# EAGLE design battery_monitor_6803-2_Rev4 (EAGLE 7.3.0)
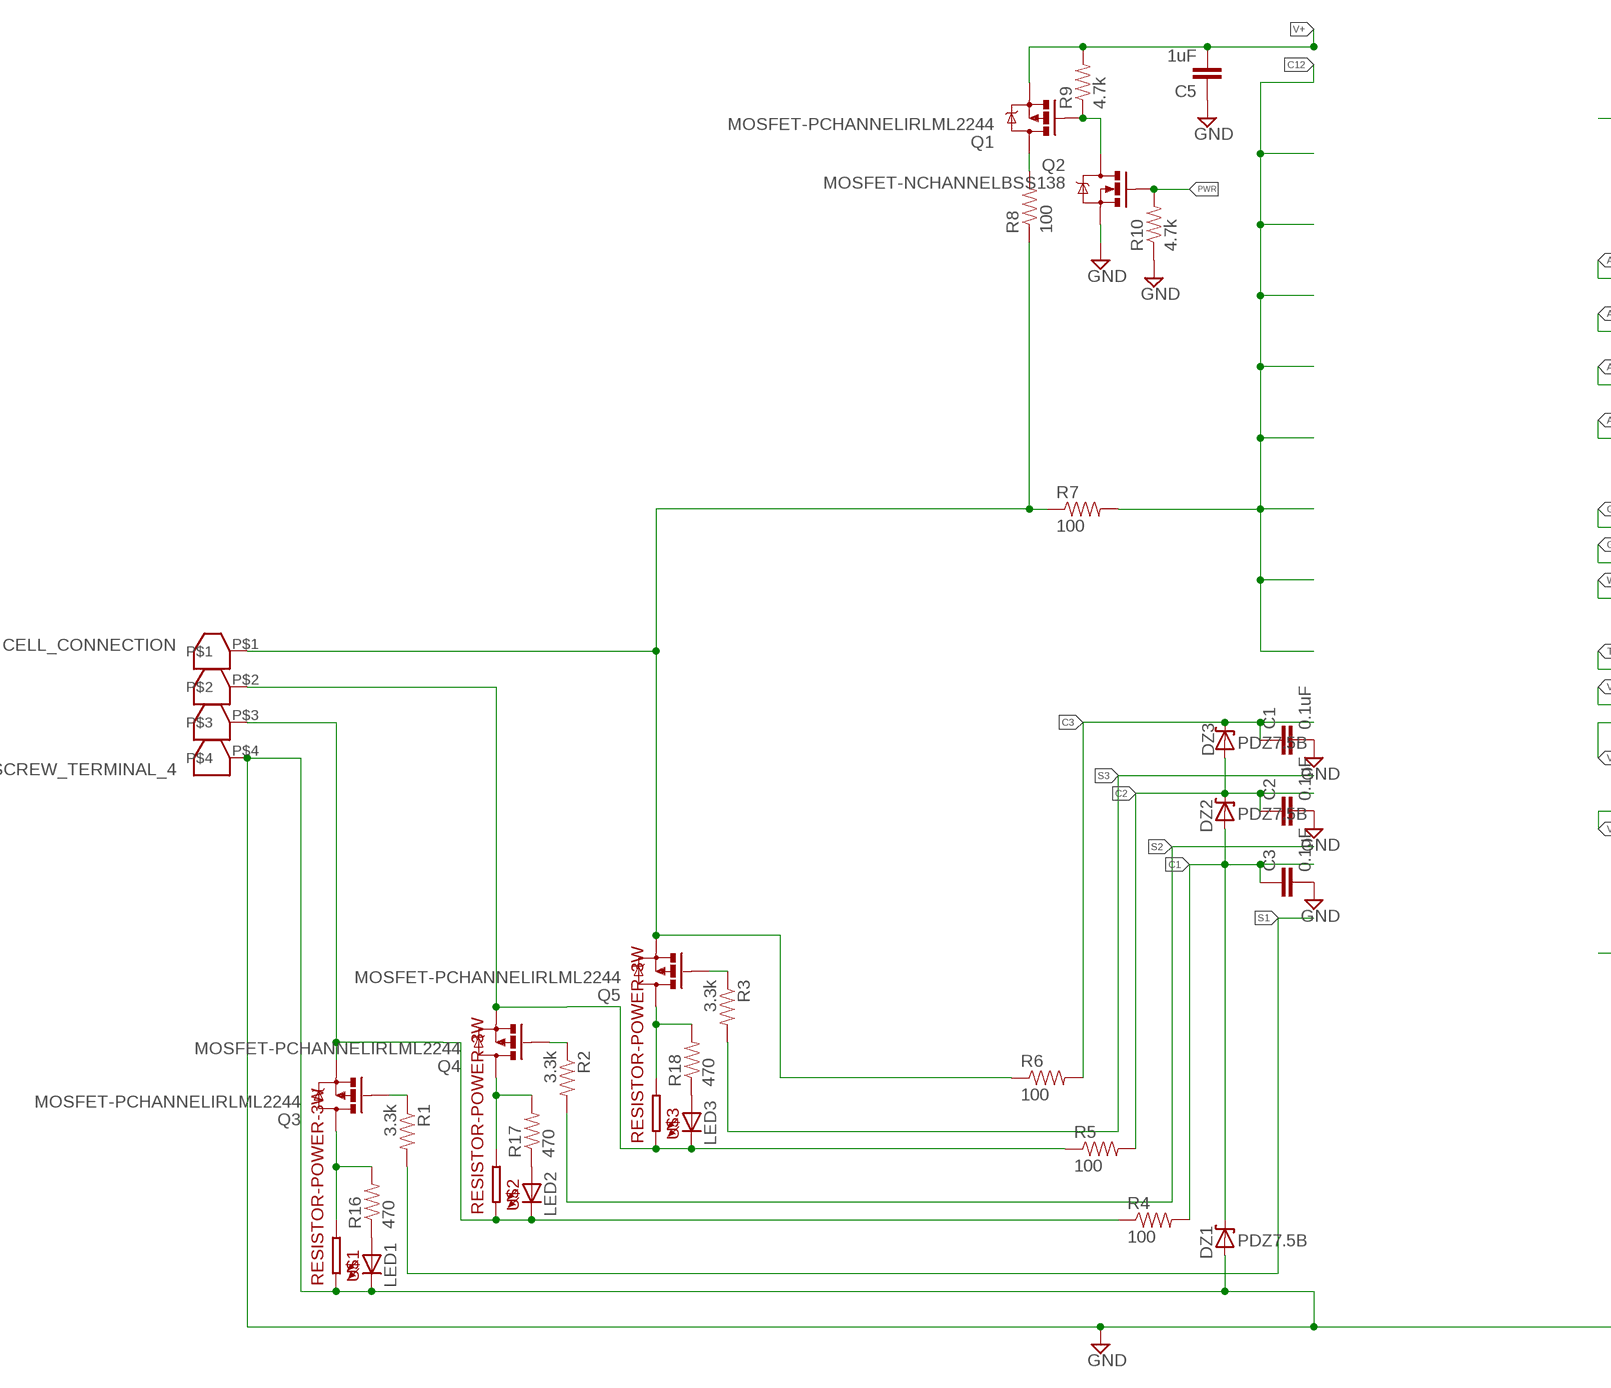
[diagram p0: schematic, sheet 1, part 1 of 2]
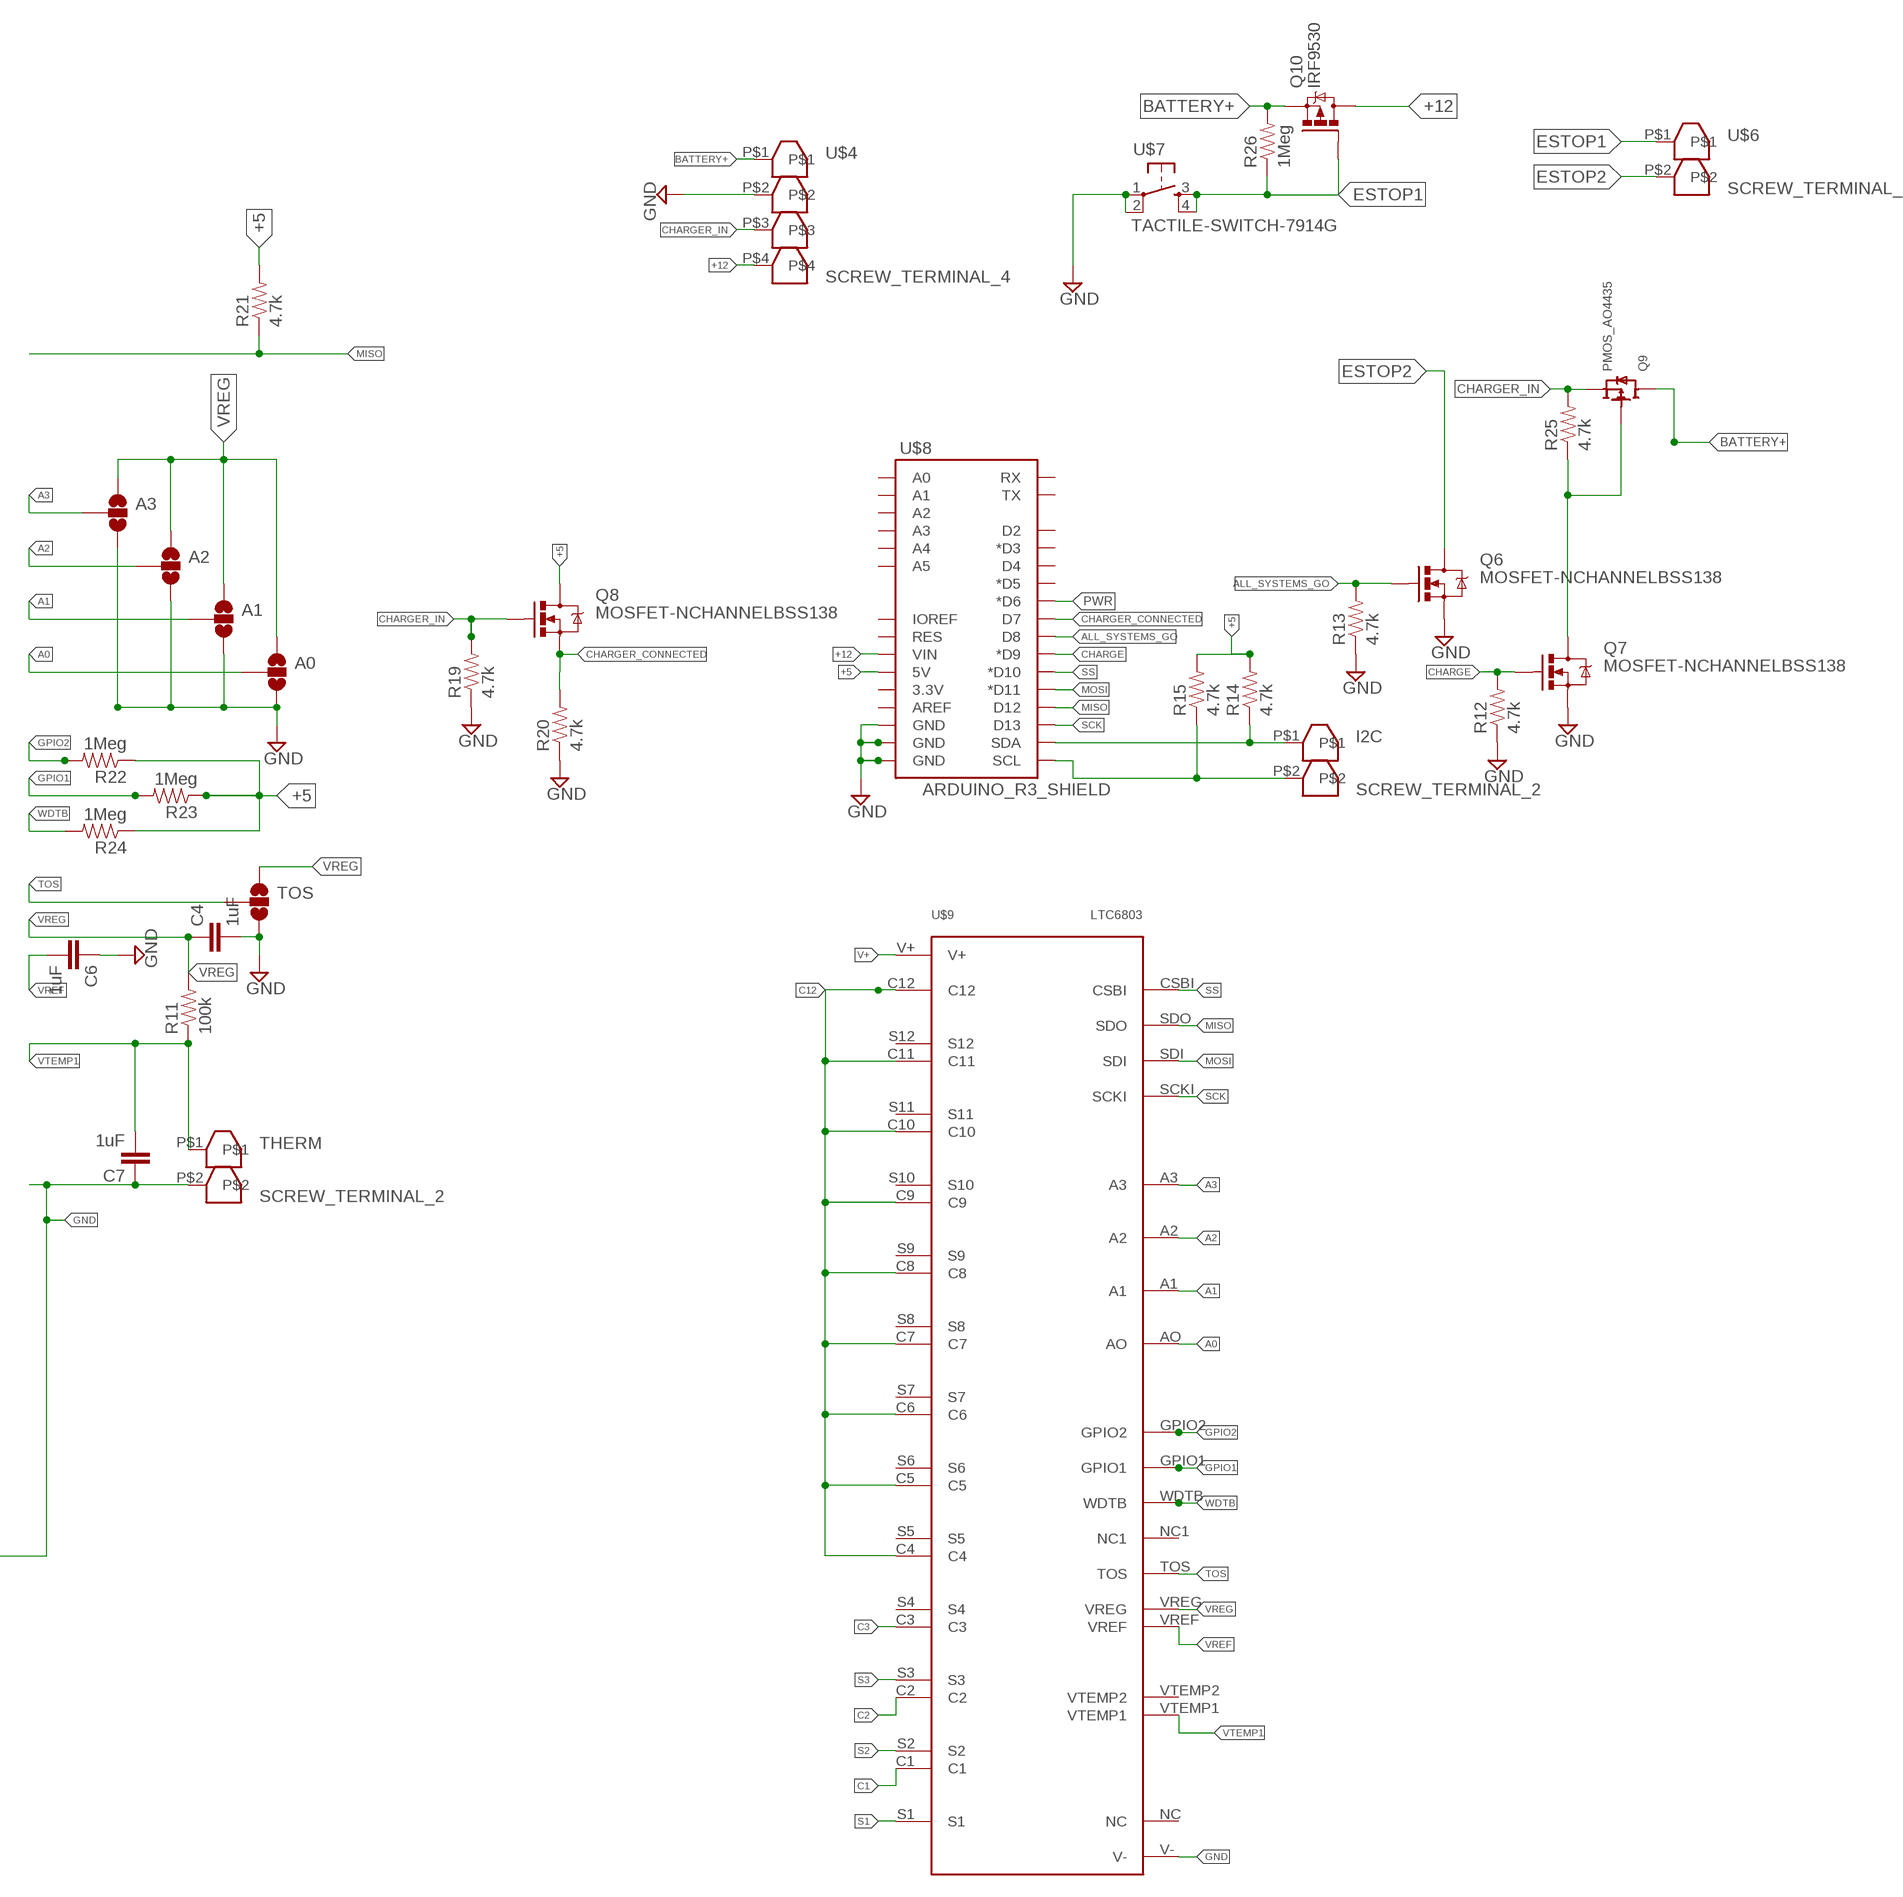
[diagram p1: schematic, sheet 1, part 2 of 2]

## Parts
A0  SOLDERJUMPER_2WAYS  [SJ_3]
A1  SOLDERJUMPER_2WAYS  [SJ_3]
A2  SOLDERJUMPER_2WAYS  [SJ_3]
A3  SOLDERJUMPER_2WAYS  [SJ_3]
C1  0.1uF  0.1UF-100V-10%(0603)  [0603-CAP]
C2  0.1uF  0.1UF-100V-10%(0603)  [0603-CAP]
C3  0.1uF  0.1UF-100V-10%(0603)  [0603-CAP]
C4  1uF  0.1UF-100V-10%(0603)  [0603-CAP]
C5  1uF  0.1UF-100V-10%(0603)  [0603-CAP]
C6  1uF  0.1UF-100V-10%(0603)  [0603-CAP]
C7  1uF  0.1UF-100V-10%(0603)  [0603-CAP]
CELL_CONNECTION  SCREW_TERMINAL_4  [SCREW_TERMINAL_4]
DZ1  PDZ7.5B  DIODE-ZENER-BZT52  [SOD-323]
DZ2  PDZ7.5B  DIODE-ZENER-BZT52  [SOD-323]
DZ3  PDZ7.5B  DIODE-ZENER-BZT52  [SOD-323]
I2C  SCREW_TERMINAL_2  [SCREW_TERMINAL_2]
LED1  LED0603  [LED-0603]
LED2  LED0603  [LED-0603]
LED3  LED0603  [LED-0603]
Q1  MOSFET-PCHANNELIRLML2244  [SOT23-3]
Q2  MOSFET-NCHANNELBSS138  [SOT23]
Q3  MOSFET-PCHANNELIRLML2244  [SOT23-3]
Q4  MOSFET-PCHANNELIRLML2244  [SOT23-3]
Q5  MOSFET-PCHANNELIRLML2244  [SOT23-3]
Q6  MOSFET-NCHANNELBSS138  [SOT23]
Q7  MOSFET-NCHANNELBSS138  [SOT23]
Q8  MOSFET-NCHANNELBSS138  [SOT23]
Q9  PMOS_AO4435  [SOIC8]
Q10  IRF9530  [TO220BV]
R1  3.3k  3.3KOHM1/10W1%(0603)  [0603-RES]
R2  3.3k  3.3KOHM1/10W1%(0603)  [0603-RES]
R3  3.3k  3.3KOHM1/10W1%(0603)  [0603-RES]
R4  100  3.3KOHM1/10W1%(0603)  [0603-RES]
R5  100  3.3KOHM1/10W1%(0603)  [0603-RES]
R6  100  3.3KOHM1/10W1%(0603)  [0603-RES]
R7  100  3.3KOHM1/10W1%(0603)  [0603-RES]
R8  100  3.3KOHM1/10W1%(0603)  [0603-RES]
R9  4.7k  3.3KOHM1/10W1%(0603)  [0603-RES]
R10  4.7k  3.3KOHM1/10W1%(0603)  [0603-RES]
R11  100k  3.3KOHM1/10W1%(0603)  [0603-RES]
R12  4.7k  3.3KOHM1/10W1%(0603)  [0603-RES]
R13  4.7k  3.3KOHM1/10W1%(0603)  [0603-RES]
R14  4.7k  3.3KOHM1/10W1%(0603)  [0603-RES]
R15  4.7k  3.3KOHM1/10W1%(0603)  [0603-RES]
R16  470  3.3KOHM1/10W1%(0603)  [0603-RES]
R17  470  3.3KOHM1/10W1%(0603)  [0603-RES]
R18  470  3.3KOHM1/10W1%(0603)  [0603-RES]
R19  4.7k  3.3KOHM1/10W1%(0603)  [0603-RES]
R20  4.7k  3.3KOHM1/10W1%(0603)  [0603-RES]
R21  4.7k  3.3KOHM1/10W1%(0603)  [0603-RES]
R22  1Meg  3.3KOHM1/10W1%(0603)  [0603-RES]
R23  1Meg  3.3KOHM1/10W1%(0603)  [0603-RES]
R24  1Meg  3.3KOHM1/10W1%(0603)  [0603-RES]
R25  4.7k  3.3KOHM1/10W1%(0603)  [0603-RES]
R26  1Meg  3.3KOHM1/10W1%(0603)  [0603-RES]
THERM  SCREW_TERMINAL_2  [SCREW_TERMINAL_2]
TOS  SOLDERJUMPER_2WAYS  [SJ_3]
U$1  RESISTOR-POWER-3W  [RESISTOR-3W]
U$2  RESISTOR-POWER-3W  [RESISTOR-3W]
U$3  RESISTOR-POWER-3W  [RESISTOR-3W]
U$4  SCREW_TERMINAL_4  [SCREW_TERMINAL_4]
U$6  SCREW_TERMINAL_2  [SCREW_TERMINAL_2]
U$7  TACTILE-SWITCH-7914G  [7914G]
U$8  ARDUINO_R3_SHIELD  [UNO_R3_SHIELD]
U$9  LTC6803  LTC6803_BREAKOUT  [LTC6803_BREAKOUT]

## Nets
+5: Q8.3(D) R14.2 R15.2 R21.2 R22.1 R23.1 R24.1 U$8.5V
+12: Q10.D U$4.P$4 U$8.VIN
A0: A0.2 U$9.AO
A1: A1.2 U$9.A1
A2: A2.2 U$9.A2
A3: A3.2 U$9.A3
ALL_SYSTEMS_GO: Q6.1(G) R13.2 U$8.D8
BATTERY+: Q9.5(DRAIN) Q9.6(DRAIN) Q9.7(DRAIN) Q9.8(DRAIN) Q10.S R26.2 U$4.P$1
C1: C3.1 DZ1.1(C) DZ2.2(A) R4.2 U$9.C1
C2: C2.1 DZ2.1(C) DZ3.2(A) R5.2 U$9.C2
C3: C1.1 DZ3.1(C) R6.2 U$9.C3
C12: R7.2 U$9.C4 U$9.C5 U$9.C6 U$9.C7 U$9.C8 U$9.C9 U$9.C10 U$9.C11 U$9.C12
CHARGE: Q7.1(G) R12.2 U$8.D9(*D9)
CHARGER_CONNECTED: Q8.2(S) R20.2 U$8.D7
CHARGER_IN: Q8.1(G) Q9.1(SOURCE) Q9.2(SOURCE) Q9.3(SOURCE) R19.2 R25.2 U$4.P$3
ESTOP1: Q10.G R26.1 U$6.P$1 U$7.3 U$7.4
ESTOP2: Q6.3(D) U$6.P$2
GND: A0.3 A1.3 A2.3 A3.3 C1.2 C2.2 C3.2 C4.2 C5.1 C6.1 C7.1 CELL_CONNECTION.P$4 DZ1.2(A) LED1.C Q2.2(S) Q6.2(S) Q7.2(S) R10.1 R12.1 R13.1 R19.1 R20.1 THERM.P$2 TOS.3 U$1.P$2 U$4.P$2 U$7.1 U$7.2 U$8.GND@0(GND) U$8.GND@1(GND) U$8.GND@2(GND) U$9.V-
GPIO1: R23.2 U$9.GPIO1
GPIO2: R22.2 U$9.GPIO2
MISO: R21.1 U$8.D12 U$9.SDO
MOSI: U$8.D11(*D11) U$9.SDI
N$1: Q7.3(D) Q9.4(GATE) R25.1
N$2: CELL_CONNECTION.P$3 LED2.C Q3.2(S) R4.1 U$2.P$2
N$3: CELL_CONNECTION.P$2 LED3.C Q4.2(S) R5.1 U$3.P$2
N$4: CELL_CONNECTION.P$1 Q5.2(S) R6.1 R7.1 R8.1
N$5: Q3.3(D) R16.2 U$1.P$1
N$7: Q3.1(G) R1.1
N$10: Q4.3(D) R17.2 U$2.P$1
N$11: Q4.1(G) R2.1
N$12: Q5.3(D) R18.2 U$3.P$1
N$13: LED1.A R16.1
N$18: Q1.3(D) R8.2
N$20: Q1.1(G) Q2.3(D) R9.1
N$22: LED2.A R17.1
N$23: LED3.A R18.1
N$29: Q5.1(G) R3.1
PWR: Q2.1(G) R10.2 U$8.D6(*D6)
S1: R1.2 U$9.S1
S2: R2.2 U$9.S2
S3: R3.2 U$9.S3
SCK: U$8.D13 U$9.SCKI
SCL: I2C.P$2 R15.1 U$8.SCL
SDA: I2C.P$1 R14.1 U$8.SDA
SS: U$8.D10(*D10) U$9.CSBI
TOS: TOS.2 U$9.TOS
V+: C5.2 Q1.2(S) R9.2 U$9.V+
VREF: C6.2 U$9.VREF
VREG: A0.1 A1.1 A2.1 A3.1 C4.1 R11.2 TOS.1 U$9.VREG
VTEMP1: C7.2 R11.1 THERM.P$1 U$9.VTEMP1
WDTB: R24.2 U$9.WDTB
Unconnected: U$8.3.3V U$8.A0 U$8.A1 U$8.A2 U$8.A3 U$8.A4 U$8.A5 U$8.AREF U$8.D2 U$8.D3(*D3) U$8.D4 U$8.D5(*D5) U$8.IOREF U$8.RES U$8.RX U$8.TX U$9.NC U$9.NC1 U$9.S4 U$9.S5 U$9.S6 U$9.S7 U$9.S8 U$9.S9 U$9.S10 U$9.S11 U$9.S12 U$9.VTEMP2

## Library data of the parts
A0 A1-A3 TOS = SparkFun:SOLDERJUMPER_2WAY: Solder Jumper 2 way solder jumper; OC_NEWARK: unknown
C1-C3 = SparkFun-Capacitors:0.1UF-100V-10%(0603): CAP-08390; MF: AVX CORPORATION; MPN: 0603YG104ZAT2A; OC_NEWARK: 01H6821; PROD_ID: CAP-08390
C4-C7 = SparkFun-Capacitors:0.1UF-100V-10%(0603): CAP-08390; MPN: C0603X5R0J105M030BC; OC_NEWARK: 04X3184; PROD_ID: CAP-08390; VALUE: 0.1uF
CELL_CONNECTION U$4 = isaac1:SCREW_TERMINAL_4; MF: TYCO ELECTRONICS; MPN: 282834-4; OC_NEWARK: 12H8388
DZ1-DZ3 = SparkFun-DiscreteSemi:DIODE-ZENER: Zener Diode Production Part - 8199 3.4V Zener Voltage; MPN: PDZ7.5B,115; OC_NEWARK: 04X4941
I2C THERM = isaac1:SCREW_TERMINAL_2; MF: TYCO ELECTRONICS; MPN: 282834-2; OC_NEWARK: 12H8386
LED1-LED3 = SparkFun-LED:LED: LEDs Standard schematic elements and footprints for 5mm, 3mm, 1206, and 0603 sized LEDs. 5mm - Spark Fun Electronics SKU : COM-00529 (and others); MPN: 150060RS75000; OC_NEWARK: 95W3795
Q1 Q3-Q5 = SparkFun-DiscreteSemi:MOSFET-PCHANNEL: Generic PMOSFET; MPN: IRLML2244TRPBF; OC_NEWARK: 40T7448; PROD_ID: TRANS-11153
Q2 Q6-Q8 = SparkFun-DiscreteSemi:MOSFET-NCHANNEL: Common NMOSFET Parts MFG P/N Store ID Prod ID FDD8780 TRANS-09984 SI7820DN TRANS-11055 FDS6630A IC-08089 2N7002PW TRANS-11151 FQP30N06L COM-10213 TRANS-10060 BSS123LT1G TRANS-08345 BSS138 TRANS-00830 BS170 2N7000; MPN: IRLML0030TRPBF; OC_NEWARK: 52R2613; PROD_ID: TRANS-00830
Q9 = isaac1:PMOS_AO4435; MPN: SI9407BDY-T1-GE3; OC_NEWARK: 16P3885
Q10 = Adams Chips:IRF9530: P-CHANNEL HEXFET POWER-MOS-FET Source: http://www.irf.com/product-info/datasheets/data/irf9530.pdf; MPN: NTE2383; OC_NEWARK: 14T4215
R1-R3 = SparkFun-Resistors:3.3KOHM1/10W1%(0603): RES-07851; MF: VISHAY/DALE; MPN: CRCW06033K00FKEA; OC_NEWARK: 52K8368; PROD_ID: RES-07851
R4-R8 = SparkFun-Resistors:3.3KOHM1/10W1%(0603): RES-07851; MPN: ERJ-1GNF1000C; OC_NEWARK: 05X8794; PROD_ID: RES-07851
R9 R10 R12-R15 R19-R21 R25 = SparkFun-Resistors:3.3KOHM1/10W1%(0603): RES-07851; MF: VISHAY/DALE; MPN: CRCW06034K70FKEA; OC_NEWARK: 52K8494; PROD_ID: RES-07851
R11 = SparkFun-Resistors:3.3KOHM1/10W1%(0603): RES-07851; MF: FARNELL; MPN: MC0063W06035100K; OC_NEWARK: 39K0075; PROD_ID: RES-07851
R16-R18 = SparkFun-Resistors:3.3KOHM1/10W1%(0603): RES-07851; MPN: ERJ-P03F4700V; OC_NEWARK: 05X8640; PROD_ID: RES-07851
R22-R24 R26 = SparkFun-Resistors:3.3KOHM1/10W1%(0603): RES-07851; MPN: ERJ-3EKF1004V; OC_NEWARK: 64R5311; PROD_ID: RES-07851
U$1-U$3 = isaac1:RESISTOR-POWER-3W: PR03 series .205" dia x .657" L; MPN: ERG-3SJ200; OC_NEWARK: 52W7905
U$6 = Isaac:SCREW_TERMINAL_2; MF: TYCO ELECTRONICS; MPN: 282834-2; OC_NEWARK: 12H8386
U$7 = GeekAmmo:TACTILE-SWITCH: Tactile Switch 4 Pins, SPST NO; MF: BOURNS, INC.; MPN: 7914G-1-000E; OC_NEWARK: 05B2757
U$8 = SparkFun-Boards:ARDUINO_R3_SHIELD: Shield form compatible with the Arduino Uno R3.; OC_NEWARK: unknown
U$9 = Clayton:LTC6803_BREAKOUT; MPN: LTC6803IG-2#PBF; OC_NEWARK: 27T5837

## Board
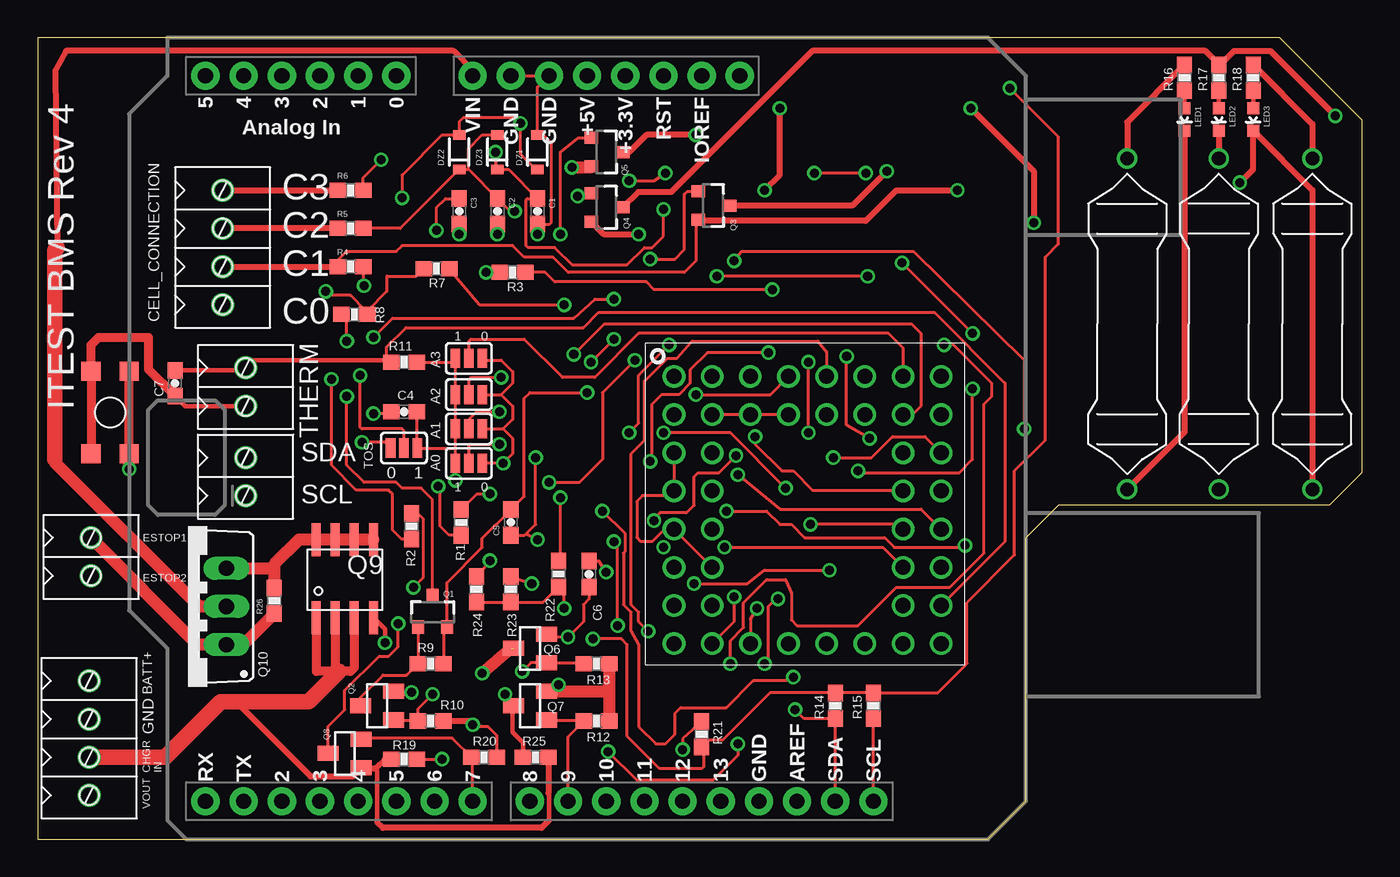
[diagram p2: board, top side]
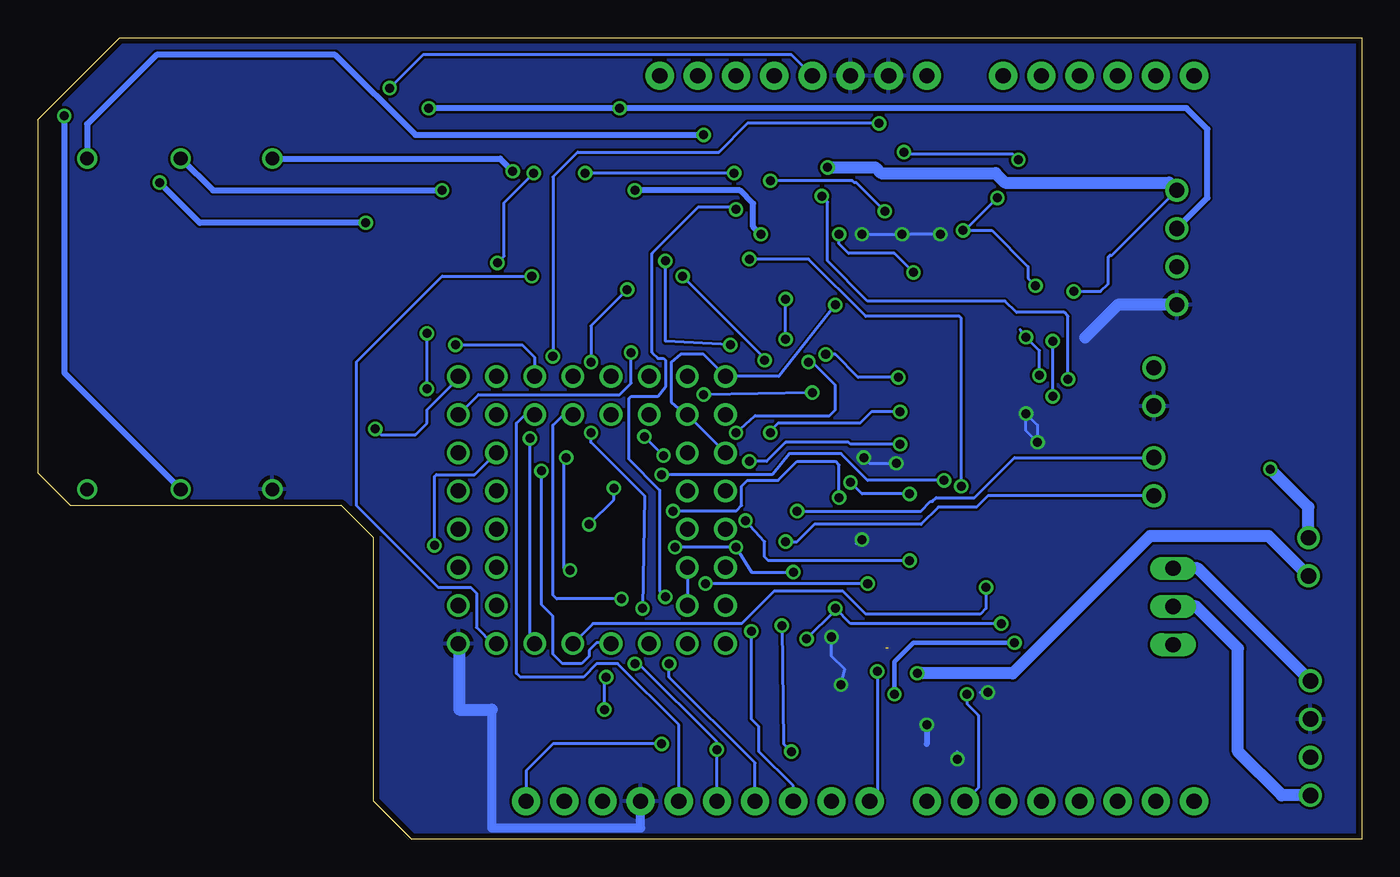
[diagram p3: board, bottom side, seen from below]

Size 88.14 x 53.34 mm. Coordinates in mm from the lower left corner, seen from the top.
Outline: 0,0 63.25,0 65.79,2.54 65.79,20.07 67.94,22.22 85.98,22.22 88.14,24.38 88.14,47.88 82.68,53.34 0,53.34 0,0
Copper layers (1*16): Top 0.0356mm / dielectric 1.5011mm / Bottom 0.0356mm
Design rules "LaenPCBOrder": minimum track width 6mil, minimum drill 13mil, track to track 6mil, track to pad 6mil, pad to pad 6mil, via to via 6mil, smd to smd 6mil, copper to edge 15mil, drill to drill 6mil, minimum pad ring 7mil, minimum via ring 7mil, stop-mask expansion 3mil, vias tented up to drill 0mil, thermal gap 10mil

### Footprints (pad centres in the part's own frame; a part is rotated, then mirrored left to right if it is on the bottom)
SJ_3 = smd 0.635 x 1.27: 1 -0.889,0; 2 0,0; 3 0.889,0
0603-CAP = smd 1.1 x 1: 1 -0.85,0; 2 0.85,0
SCREW_TERMINAL_4 = drill 1.016 pad 1.422: P$1 0,3.81; P$2 0,1.27; P$3 0,-1.27; P$4 0,-3.81
SOD-323 = smd 0.63 x 0.83: 1 -1.15,0; 2 1.15,0
SCREW_TERMINAL_2 = drill 1.016 pad 1.422: P$1 0,1.27; P$2 0,-1.27
LED-0603 = smd 0.8 x 0.8: A 0,-0.75; C 0,0.75
SOT23-3 = smd 0.8 x 0.9: 1 -0.95,-1; 2 0.95,-1; 3 0,1.1
SOT23 = smd 1 x 1.4: 1 -0.95,-1.1; 2 0.95,-1.1; 3 0,1.1
SOIC8 = smd 0.6 x 2.2: 1 -1.905,-2.54; 2 -0.635,-2.54; 3 0.635,-2.54; 4 1.905,-2.54; 5 1.905,2.66; 6 0.635,2.66; 7 -0.635,2.66; 8 -1.905,2.66
TO220BV = drill 1.016 long: D 0,-2.54; G -2.54,-2.54; S 2.54,-2.54
0603-RES = smd 1.1 x 1: 1 -0.85,0; 2 0.85,0
RESISTOR-3W = drill 0.9: P$1 0,11; P$2 0,-11
7914G = smd 1.27 x 1.27: 1 0,0; 2 0,5.486; 3 2.54,0; 4 2.54,5.486
UNO_R3_SHIELD = drill 1.016 pad 1.88: 3.3V 50.8,26.67; 5V 50.8,29.21; A0 50.8,41.91; A1 50.8,44.45; A2 50.8,46.99; A3 50.8,49.53; A4 50.8,52.07; A5 50.8,54.61; AREF 2.54,15.24; D2 2.54,49.53; D3 2.54,46.99; D4 2.54,44.45; D5 2.54,41.91; D6 2.54,39.37; D7 2.54,36.83; D8 2.54,33.02; D9 2.54,30.48; D10 2.54,27.94; D11 2.54,25.4; D12 2.54,22.86; D13 2.54,20.32; GND@0 50.8,31.75; GND@1 50.8,34.29; GND@2 2.54,17.78; IOREF 50.8,21.59; NC 50.8,19.05; RES 50.8,24.13; RX 2.54,54.61; SCL 2.54,10.16; SDA 2.54,12.7; TX 2.54,52.07; VIN 50.8,36.83
LTC6803_BREAKOUT = drill 1: A1 19.748,19.241; A2 17.209,16.701; A3 17.209,19.241; AO 19.748,16.701; C1 14.668,1.46; C2 9.588,1.46; C3 4.508,1.46; C4 4.508,4; C5 4.508,6.54; C6 1.968,9.081; C7 1.968,11.62; C8 1.968,14.161; C9 1.968,19.241; C10 4.508,16.701; C11 7.048,16.701; C12 9.588,16.701; CSBI 12.129,19.241; GPIO1 19.748,14.161; GPIO2 17.209,14.161; NC 17.209,4; NC1 19.748,11.62; S1 17.209,1.46; S2 12.129,1.46; S3 7.048,1.46; S4 1.968,1.46; S5 1.968,4; S6 1.968,6.54; S7 4.508,9.081; S8 4.508,11.62; S9 4.508,14.161; S10 1.968,16.701; S11 4.508,19.241; S12 7.048,19.241; SCKI 14.668,16.701; SDI 14.668,19.241; SDO 12.129,16.701; TOS 17.209,9.081; V+ 9.588,19.241; V- 19.748,1.46; VREF 17.209,6.54; VREG 19.748,9.081; VTEMP1 19.748,4; VTEMP2 19.748,6.54; WDTB 17.209,11.62

### Placement (x,y rotation side)
A0  28.7,25.02 0 top
A1  28.7,27.3 0 top
A2  28.7,29.59 0 top
A3  28.7,32 0 top
C1  33.27,41.78 270 top
C2  30.61,41.78 270 top
C3  28.07,41.78 270 top
C4  24.38,28.45 180 top
C5  31.5,21.08 90 top
C6  36.7,17.65 90 top
C7  9.14,30.35 90 top
CELL_CONNECTION  12.32,39.37 0 top
DZ1  33.27,45.72 90 top
DZ2  28.07,45.72 90 top
DZ3  30.61,45.72 90 top
I2C  13.84,24.13 0 top
LED1  76.33,47.88 180 top
LED2  78.61,47.88 180 top
LED3  80.9,47.88 180 top
Q1  26.29,15.11 0 top
Q2  22.61,8.89 90 top
Q3  44.96,42.16 270 top
Q4  37.85,42.04 270 top
Q5  37.85,45.72 270 top
Q6  32.77,12.7 90 top
Q7  32.77,8.89 90 top
Q8  20.45,5.71 90 top
Q9  20.45,17.27 0 top
Q10  10.03,15.49 90 top
R1  28.19,21.08 90 top
R2  24.89,20.83 90 top
R3  31.62,37.72 0 top
R4  20.83,38.1 0 top
R5  20.83,40.64 0 top
R6  20.83,43.18 0 top
R7  26.54,37.97 0 top
R8  21.08,34.92 180 top
R9  26.16,11.68 0 top
R10  26.16,7.87 180 top
R11  24.38,31.75 0 top
R12  37.21,7.87 180 top
R13  37.21,11.68 180 top
R14  53.09,8.89 90 top
R15  55.63,8.89 90 top
R16  76.33,50.67 90 top
R17  78.61,50.67 90 top
R18  80.9,50.67 90 top
R19  24.38,5.33 180 top
R20  29.72,5.46 180 top
R21  44.2,6.98 270 top
R22  34.67,17.65 90 top
R23  31.5,16.64 90 top
R24  29.21,16.64 90 top
R25  33.15,5.46 0 top
R26  15.75,15.88 90 top
THERM  13.84,30.1 0 top
TOS  24.38,26.04 180 top
U$1  72.52,34.29 0 top
U$2  78.61,34.29 180 top
U$3  84.84,34.29 0 top
U$4  3.43,6.73 0 top
U$6  3.56,18.8 0 top
U$7  3.56,25.65 0 top
U$8  65.79,0 90 top
U$9  40.39,11.56 0 top

### Tracks (layer width: path | path; a pad name or v marks a point on that pad's centre or on a via)
+5  (via drill 0.6)
  Top 0.203: R15.2 R14.2 48.73,9.74 45.59,6.6 44.66,6.6 R21.2 44.32,6.01 44.32,4.83 44.2,4.7 41.4,4.7 39.24,6.86 39.24,12.95 38.86,13.33 v36.96,13.33 | Q8.3 19.35,7.54 20.45,8.64 20.45,9.91 22.73,12.19 23.37,12.19 24,12.83 v24,14.35 | v35.05,15.37 35.05,16.42 R22.1 33.66,15.79 R23.1 R24.1 | R15.2 55.66,9.78 | v64.71,49.97 67.94,46.74 67.94,39.62 67.06,38.73 67.06,26.54 65.02,24.51 65.02,18.92 61.85,15.75 61.85,11.68 59.91,9.74 R15.2
  Bottom 0.203: v24,14.35 34.04,14.35 v35.05,15.37 35.05,15.24 v36.96,13.33 | U$8.5V 37.97,52.2 62.48,52.2 v64.71,49.97
+12
  Top 0.406: U$8.VIN 28.96,51.18 27.69,52.45 1.9,52.45 1.19,51.14 1.31,39.37
  Top 0.813: Q10.D 10.71,15.49 1.14,25.06 1.14,25.27
  Top 1.016: 1.14,25.27 1.14,39.2 1.31,39.37
  Bottom 0.813: U$4.P$4 5.33,2.92 8.25,5.84 8.25,12.7 11.05,15.49 Q10.D
A0  (via drill 0.6)
  Top 0.203: A0.2 28.7,26.16 28.83,26.29 v30.73,26.29 | v48.64,32.38 44.58,32.38 43.43,31.24 43.43,30.35 42.67,29.59 41.53,29.59 40.89,28.96 40.89,25.27 v40.77,25.15
  Bottom 0.203: v30.73,26.29 34.04,26.29 34.16,26.42 38.35,26.42 39.62,25.15 v40.77,25.15 | U$9.AO 58.8,29.59 49.4,29.59 48.64,30.35 v48.64,32.38
A1  (via drill 0.6)
  Top 0.203: A1.2 28.7,27.94 29.21,28.45 v30.73,28.45 | v39.37,27.05 40.01,27.69 40.01,30.86 v42.04,32.89 | v46.35,38.48 46.86,39.12 58.29,39.12 65.66,31.88 v65.66,27.3
  Bottom 0.203: v30.73,28.45 32.64,28.45 33.4,27.69 38.86,27.69 39.37,27.18 v39.37,27.05 | v42.04,32.89 46.35,33.15 v46.35,38.48 | v65.66,27.3 65.28,26.92 62.99,26.92 62.23,27.69 62.23,28.57 60.13,30.67 U$9.A1
A2  (via drill 0.6)
  Top 0.203: A2.2 28.7,30.61 28.83,30.73 v30.86,30.73 | v35.69,32.26 37.72,34.29 58.17,34.29 58.8,33.66 58.8,28.83 58.23,28.26 U$9.A2
  Bottom 0.203: v30.86,30.73 33.53,30.73 35.05,32.26 v35.69,32.26
A3
  Top 0.203: U$9.A3 57.59,32.7 56.64,33.66 40.01,33.66 37.08,30.73 34.92,30.73 32.38,33.27 28.83,33.27 28.7,33.15 A3.2
ALL_SYSTEMS_GO  (via drill 0.6)
  Top 0.203: 36.3,11.75 Q6.1 32.83,11.75 v32.26,11.18
  Top 0.813: 36.3,11.75 R13.2
  Bottom 0.203: v32.26,11.18 32.26,3.05 U$8.D8
BATTERY+
  Top 0.813: Q10.S 15.75,18.03 | Q9.5 Q9.6 Q9.7 Q9.8 18.54,19.94 17.4,19.94 15.75,18.29 15.75,18.03 | 15.75,18.03 R26.2
  Bottom 0.813: U$4.P$1 10.92,18.03 Q10.S
C1  (via drill 0.6)
  Top 0.203: DZ1.1 33.15,44.57 32.13,45.59 v32.13,47.62 32.13,47.75 31.88,48.01 28.32,48.01 28.07,47.75 DZ2.2 26.92,46.86 24.26,44.2 v24.26,42.67 | 27.72,42.63 C3.1 27.14,42.63 26.54,42.04 v26.54,40.51 | R4.2 21.68,36.87 v21.72,36.83 | v55.37,26.67 53.85,27.56 v53.85,32.13
  Bottom 0.203: v21.72,36.83 22.22,37.34 22.22,38.1 24.64,40.51 v26.54,40.51 26.42,40.51 v24.26,42.67 | U$9.C1 55.37,13.33 v55.37,26.67 | v53.85,32.13 53.85,44.07 52.2,45.72 42.8,45.72 40.89,47.62 v32.13,47.62
C2  (via drill 0.6)
  Top 0.203: 28.67,44.57 DZ2.1 24.14,40.64 R5.2 | 28.67,44.57 C2.1 31.46,41.78 v31.75,41.78 | 28.67,44.57 28.67,45.94 29.59,46.86 DZ3.2 | v39.37,43.81 41.02,43.81 v41.78,44.32 | v54.61,24.51 54.74,24.38 61.34,24.38 62.23,25.27 v62.23,29.97 | v57.53,38.35 v62.23,33.66 | v55.12,44.32 v51.69,44.32
  Bottom 0.203: v31.75,41.78 33.66,43.69 33.78,43.69 33.91,43.81 v39.37,43.81 | U$9.C2 50.04,13.08 50.93,13.08 51.44,12.57 51.44,12.19 51.94,11.68 53.21,11.68 53.85,12.32 53.85,14.86 54.61,15.62 v54.61,24.51 | v62.23,29.97 v62.23,33.66 | v41.78,44.32 v51.69,44.32 | v55.12,44.32 57.09,42.35 57.09,38.8 v57.53,38.35
C3  (via drill 0.6)
  Top 0.203: R6.2 21.68,44.03 v22.86,45.21 | v30.48,45.72 30.48,44.7 DZ3.1 31.34,44.57 C1.1 32.6,42.63 32.51,42.55 32.51,39.5 32.64,39.37 34.42,39.37 35.56,38.23 39.24,38.23 40.39,39.37 40.89,39.37 41.66,40.13 v41.66,41.91 | v46.35,16.13 46.35,14.48 U$9.C3
  Bottom 0.203: v22.86,45.21 23.24,45.59 30.35,45.59 v30.48,45.72 | v41.66,41.91 41.78,42.04 44.2,42.04 47.24,38.99 47.24,32.38 46.86,32 46.48,32 46.35,31.88 46.35,30.1 46.86,29.46 48.64,29.46 48.77,29.34 48.77,25.27 46.74,23.24 46.74,16.51 v46.35,16.13
C12  (via drill 0.6)
  Top 0.203: R7.2 29.43,35.56 v35.05,35.56 | U$9.C8 U$9.C7 42.04,22.86 40.26,22.86 39.88,22.48 39.88,20.07 40.13,19.81 40.89,19.81 41.78,20.7 42.29,20.7 U$9.C6 U$9.C5 | U$9.C12 U$9.C11 U$9.C10
  Bottom 0.203: v35.05,35.56 38.8,30.8 U$9.C9 43.81,32.26 45.34,32.26 45.97,31.75 45.97,29.08 45.02,28.26 U$9.C10 U$9.C8 | U$9.C5 U$9.C4
CHARGE
  Top 0.203: Q7.1 36.3,7.94 R12.2 35.31,6.82 U$8.D9
CHARGER_CONNECTED
  Top 0.203: U$8.D7 28.96,5.37 R20.2 27.6,6.73 21.61,6.73 Q8.2
CHARGER_IN
  Top 0.203: R19.2 23.11,5.33 | 21.61,4.7 Q8.1 | 34,3.09 34.04,3.05 | 22.61,4.57 22.48,4.7
  Top 0.305: 34.04,3.05 34.04,1.27 | 22.61,1.14 22.61,4.57
  Top 0.406: 23.11,5.33 22.48,4.7 21.61,4.7 | R25.2 34,3.09 | 34.04,1.27 33.53,0.76 22.99,0.76 22.61,1.14 | 13.21,9.14 18.16,4.19 20.97,4.19 Q8.1
  Top 0.61: Q9.1 18.54,11.18 19.56,11.18 | Q9.2 19.81,11.43 19.56,11.18 | Q9.3 21.08,11.43 20.83,11.18 20.07,11.18 19.56,11.18
  Top 1.016: U$4.P$3 8.51,5.46 12.19,9.14 13.21,9.14 18.03,9.14 20.07,11.18
ESTOP1  (via drill 0.6)
  Top 0.61: Q10.G 13.68,12.95 | U$7.3 U$7.4
  Top 0.813: 13.68,12.95 R26.1 | v6.1,24.64 U$7.3 | Q10.G 10.67,12.95 U$6.P$1
  Bottom 0.813: U$6.P$1 3.56,22.1 v6.1,24.64
ESTOP2  (via drill 0.6)  (1 unrouted)
  Top 0.813: 31.5,12.7 v29.59,11.05
  Bottom 0.813: v29.59,11.05 23.24,11.05 14.1,20.19 6.22,20.19 U$6.P$2
GND  (via drill 0.6)
  Top 0.203: C3.2 v28.07,40.26 | v30.61,40.26 C2.2 | v33.27,40.26 C1.2 33.31,40.89 34.04,40.89 34.16,41.02 34.16,46.35 33.65,46.87 DZ1.2 33.27,50.04 U$8.GND@0 U$8.GND@1 | Q2.2 23.89,9.65 24.77,9.65 v24.89,9.78 | R19.1 v26.92,5.33 | R20.1 30.57,6.9 29.97,7.49 29.08,7.49 v28.96,7.62 | C5.1 32.42,20.23 32.51,20.32 | Q7.2 33.97,9.84 v34.67,10.29 | Q6.2 34.05,13.46 v35.31,13.46 36.32,14.48 36.32,15.62 36.7,16 C6.1 | 32.51,20.32 33.15,20.95 v33.15,25.4 | 32.51,20.32 v33.27,19.94 | A3.3 29.72,31.88 30.86,31.88 31.62,31.11 31.62,30.35 30.86,29.59 | A2.3 30.86,29.59 | 30.86,29.59 31.62,28.83 31.62,27.94 30.99,27.3 | A1.3 30.99,27.3 | 30.99,27.3 31.62,26.67 31.62,25.65 v30.99,25.02 A0.3 | TOS.3 23.11,26.42 v21.59,26.42 | C4.2 23.41,28.32 v22.35,28.32
  Top 0.305: THERM.P$2 9.82,28.83 C7.1
  Top 0.406: R10.1 28.7,7.87 v28.96,7.62 | LED1.C 76.33,27.1 U$1.P$2
  Top 0.61: U$7.1 U$7.2 3.56,32.89 4.06,33.4 7.37,33.4 7.37,31.28 C7.1
  Top 0.813: R12.1 38.06,10.16 | 38.06,10.16 R13.1 | Q7.2 37.74,9.84 38.06,10.16
  Bottom 0.203: v28.07,40.26 v30.61,40.26 v33.27,40.26 | v26.92,5.33 26.92,5.84 | v24.89,9.78 25.4,9.78 | v34.67,10.29 34.42,11.3 35.31,12.19 v35.31,13.46 | v33.27,19.94 33.66,19.68 | v33.15,25.4 32.77,25.02 v30.99,25.02 | v21.59,26.42 22.35,27.18 v22.35,28.32 21.59,27.56 v21.59,26.42
  Bottom 0.406: v28.96,7.62 28.96,6.35 | U$9.V- 60.07,13.02
  Bottom 0.61: 57.91,8.64 57.91,0.76 48.01,0.76 U$8.GND@2
  Bottom 0.813: CELL_CONNECTION.P$4 16.26,35.56 18.41,33.4 | 60.07,13.02 60.07,8.64 57.91,8.64
  pour Bottom: -0.25,-0.25 92.46,-0.38 92.58,53.85 -0.89,54.61
GPIO1  (via drill 0.6)
  Top 0.203: R23.2 32.22,17.23 v32.89,17.02 | v43.69,17.02 47.24,17.02 48.39,17.91 v52.7,17.91 | v52.96,25.4 55.5,25.4 56.9,26.8 59.05,26.8 U$9.GPIO1
  Bottom 0.203: v32.89,17.02 v43.69,17.02 | v52.7,17.91 52.96,17.91 53.09,18.03 53.09,25.27 v52.96,25.4
GPIO2  (via drill 0.6)
  Top 0.203: R22.2 34.8,18.5 v34.8,22.73 | v45.85,21.84 48.51,21.84 49.4,20.95 50.16,20.95 51.05,20.07 56.39,20.07 57.02,19.43 61.59,19.43 v61.72,19.56
  Bottom 0.203: v34.8,22.73 34.8,24.89 35.05,25.15 37.59,25.15 38.86,23.88 40.89,23.88 41.27,23.5 41.27,22.22 41.66,21.84 v45.85,21.84 | v61.72,19.56 61.72,24.13 61.59,24.26 59.05,24.26 U$9.GPIO2
MISO  (via drill 0.6)
  Top 0.203: v48.39,11.68 48.64,11.94 48.64,15.49 49.15,16 v49.28,16 | R21.1 42.93,6.69 v42.93,5.97
  Bottom 0.203: U$8.D12 v42.93,5.97 42.93,6.48 48.13,11.68 v48.39,11.68 | v49.28,16 53.59,16 53.85,16.26 53.85,27.56 53.15,28.26 U$9.SDO
MOSI  (via drill 0.6)
  Top 0.203: 60.71,32.89 v60.32,32.89 60.96,32.89 63.5,30.35 63.5,29.46 62.99,28.96 62.99,19.05 60.71,16.76 57.15,16.76 54.61,14.22 50.55,14.22 50.16,14.61 50.16,16.38 49.78,17.27 48.51,17.27 46.99,15.75 46.99,14.1 46.1,13.21 v46.1,11.68
  Bottom 0.203: U$8.D11 40.39,5.08 46.1,10.79 v46.1,11.68 | v60.32,32.89 55.88,32.89 55.05,32.07 U$9.SDI
N$1  (via drill 0.6)
  Top 0.203: Q7.3 31.62,8.85 31.62,9.14
  Top 0.305: R25.1 32.3,6.44 31.62,7.11 31.62,8.85 | 31.62,9.14 v31.12,9.65 | v23.11,13.08 23.11,13.97 Q9.4
  Bottom 0.305: v31.12,9.65 31.12,11.81 29.84,13.08 v23.11,13.08
N$2  (via drill 0.6)
  Top 0.203: R4.1 19.98,38.52 20.57,39.12 23.88,39.12 24.26,39.5 31.62,39.5 32.38,38.73 34.29,38.73 35.31,37.72 43.05,37.72 43.81,38.48 43.81,41.07 Q3.2
  Top 0.406: CELL_CONNECTION.P$3 R4.1 | LED2.C U$2.P$2 | Q3.2 44.02,41.15 55.12,41.15 57.15,43.18 v61.21,43.18
  Bottom 0.406: U$2.P$2 78.56,45.29 76.45,43.18 v61.21,43.18
N$3  (via drill 0.6)
  Top 0.203: LED3.C 81.16,46.86
  Top 0.406: U$3.P$2 84.84,43.19 LED3.C 80.9,44.58 v80.01,43.69 | v62.1,48.64 66.29,44.45 v66.29,41.02 | Q4.2 37.67,40.26 v40.01,40.26 | v48.39,43.18 49.4,44.2 v49.4,48.64 | R5.1 CELL_CONNECTION.P$2
  Bottom 0.406: CELL_CONNECTION.P$2 10.29,42.67 10.29,47.24 11.68,48.64 v49.4,48.64 v62.1,48.64 | v66.29,41.02 77.34,41.02 v80.01,43.69 | v40.01,40.26 40.51,40.77 40.51,42.29 41.4,43.18 v48.39,43.18
N$4  (via drill 0.6)
  Top 0.203: 20.19,43.39 R6.1 | R8.1 21.93,35.14 21.97,35.18 | 25.44,38.35 R7.1 25.18,37.46 23.24,37.46 23.24,36.45 21.97,35.18 | 21.97,35.18 21.84,35.18 20.83,36.2 19.43,36.2 v19.18,36.45
  Top 0.406: CELL_CONNECTION.P$1 R6.1
  Top 0.813: v35.56,44.7 36.78,44.7 Q5.2
  Bottom 0.203: v19.18,36.45 17.4,36.45 16.89,36.96 16.89,38.73 16.76,38.86 16.64,38.86 CELL_CONNECTION.P$1
  Bottom 0.813: v35.56,44.7 32.38,44.7 32,44.32 24.38,44.32 23.75,43.69 12.83,43.69 CELL_CONNECTION.P$1
N$5  (via drill 0.6)
  Top 0.406: R16.2 72.52,47.71 U$1.P$1 | v56.52,44.45 54.23,42.16 Q3.3
  Bottom 0.406: U$1.P$1 57.35,45.29 v56.52,44.45
N$7  (via drill 0.6)
  Top 0.203: R1.1 27.39,20.23 26.8,20.83 26.8,23.37 v26.67,23.5 | v40.77,38.61 42.42,38.61 43.05,39.24 43.05,42.93 43.24,43.11 Q3.1
  Bottom 0.203: v26.67,23.5 26.67,34.67 26.8,34.8 33.02,34.8 36.83,38.61 v40.77,38.61
N$10  (via drill 0.6)
  Top 0.406: v86.36,48.13 82.04,52.45 79.63,52.45 78.7,51.52 R17.2 78.61,51.56 77.72,52.45 51.56,52.45 42.16,43.05 39.96,43.05 Q4.3
  Bottom 0.406: v86.36,48.13 86.36,31.04 U$2.P$1
N$11  (via drill 0.6)
  Top 0.203: R2.1 24.22,19.98 23.62,20.57 23.62,22.99 23.37,23.24 21.21,23.24 19.56,24.89 v19.56,30.61 | v35.94,42.8 36.66,42.8 Q4.1
  Bottom 0.203: v35.94,42.8 35.56,42.42 35.56,38.48 32.89,35.81 23.75,35.81 22.99,35.05 19.81,35.05 19.56,34.8 v19.56,30.61
N$12  (via drill 0.6)
  Top 0.406: R18.2 84.84,47.59 U$3.P$1 | v43.81,46.86 40.51,46.86 39.37,45.72 Q5.3
  Bottom 0.406: U$3.P$1 84.84,47.59 80.22,52.2 68.33,52.2 62.99,46.86 v43.81,46.86
N$13
  Top 0.305: LED1.A R16.1
N$18  (via drill 0.6)
  Top 0.203: Q1.3 26.29,22.61 25.53,23.37 24.26,23.37 23.88,23.75 21.72,23.75 20.57,24.89 v20.57,29.46 | v20.57,33.15 20.57,34.58 R8.2
  Bottom 0.203: v20.57,29.46 v20.57,33.15
N$20
  Top 0.203: Q1.1 25.34,11.71 R9.1 24.55,10.92 22.99,10.92 21.51,9.44 Q2.3
N$22
  Top 0.305: LED2.A R17.1
N$23
  Top 0.305: LED3.A R18.1
N$29  (via drill 0.6)
  Top 0.203: R3.1 v29.84,37.72 | v34.8,40.26 34.8,45.72 36,46.67 Q5.1
  Bottom 0.203: v29.84,37.72 31.12,38.99 34.16,38.99 34.8,39.62 v34.8,40.26
PWR  (via drill 0.6)
  Top 0.203: Q2.1 25.25,7.94 R10.2 25.31,8.67 v26.29,9.65
  Bottom 0.203: v26.29,9.65 26.29,9.02 25.53,8.25 25.53,3.43 U$8.D6
S1  (via drill 0.6)
  Top 0.203: R1.2 29.25,22.99 v30.1,22.99 | v55.24,37.46 v45.21,37.46 | v39.75,31.88 37.59,29.72 37.59,25.27 36.07,23.75 v34.04,23.75
  Bottom 0.203: v30.1,22.99 33.27,22.99 v34.04,23.75 | v55.24,37.46 61.21,37.46 66.93,31.75 66.93,22.22 61.47,16.76 59.31,16.76 58.93,16.38 58.93,14.1 57.85,13.02 U$9.S1 | v45.21,37.46 39.75,32 v39.75,31.88
S2  (via drill 0.6)
  Top 0.203: R2.2 25.31,21.68 25.65,21.34 25.65,17.4 v25.02,16.76
  Bottom 0.203: U$9.S2 51.18,14.35 41.27,14.35 39.12,16.51 34.54,16.51 33.02,14.99 25.4,14.99 25.02,15.37 v25.02,16.76
S3  (via drill 0.6)
  Top 0.203: v47.88,15.37 47.44,14.67 U$9.S3 | v51.31,27.05 v51.31,31.75 | v48.89,36.58 41.02,36.58 40.51,37.08 34.42,37.08 33.78,37.72 R3.2
  Bottom 0.203: v47.88,15.37 47.75,22.86 51.31,26.42 v51.31,27.05 | v51.31,31.75 51.31,34.16 v48.89,36.58
SCK
  Bottom 0.203: U$8.D13 45.47,7.62 49.53,11.68 50.93,11.68 51.82,10.79 56.01,10.79 56.26,11.05 56.26,27.69 55.69,28.26 U$9.SCKI
SCL  (via drill 0.6)
  Top 0.203: U$8.SCL R15.1 | v46.61,6.35 46.61,5.59 44.96,3.94 39.88,3.94 v37.97,5.84 | v38.61,14.22 38.61,19.81 v38.35,19.81
  Bottom 0.203: I2C.P$2 24.89,22.86 25.65,22.1 28.19,22.1 29.34,20.95 36.45,20.95 37.59,19.81 v38.35,19.81 | v38.61,14.22 38.48,6.35 v37.97,5.84 | v46.61,6.35 53.85,6.35 55.63,4.57 U$8.SCL
SDA  (via drill 0.6)
  Top 0.203: U$8.SDA R14.1 51.02,8.04 v50.42,8.64 | v50.29,10.79 50.04,10.54 47.62,10.54 45.85,8.76 42.8,8.76 42.42,8.38 42.42,6.98 41.78,6.35 41.15,6.35 40.01,7.49 40.01,12.95 39.5,13.84 39.5,15.11 38.99,15.62 38.99,19.05 39.12,19.18 39.12,20.32 v37.59,21.84
  Bottom 0.203: v50.42,8.64 50.42,10.67 v50.29,10.79 | v37.59,21.84 29.34,21.84 28.7,22.48 28.57,22.48 28.32,22.73 25.78,22.73 23.11,25.4 I2C.P$1
SS  (via drill 0.6)
  Top 0.203: 52.51,31.18 U$9.CSBI 52.51,32.45 51.94,33.15 43.56,33.15 42.55,32 41.91,32 40.39,30.48 40.39,26.54 39.5,25.65 39.5,15.62 40.01,15.11 40.01,14.48 v40.64,13.84
  Bottom 0.203: U$8.D10 37.85,3.56 40.13,5.84 40.13,7.49 40.64,8 v40.64,13.84
TOS  (via drill 0.6)
  Top 0.203: TOS.2 24.38,27.18 24.26,27.3 21.59,27.3 21.46,27.43 v21.46,30.86 | v22.35,33.4 23.62,34.67 35.69,34.67 37.08,35.94 v38.35,35.94 | U$9.TOS 57.28,20.95 v51.44,20.95 | v49.78,23.37 46.1,27.05 v41.66,27.05 | v36.83,31.75 v38.35,33.27
  Bottom 0.203: v21.46,30.86 21.59,30.99 21.46,31.11 21.46,32.51 v22.35,33.4 22.73,33.91 | v51.44,20.95 49.78,22.61 v49.78,23.37 | v41.66,27.05 40.39,28.19 35.43,28.19 35.05,28.57 35.05,30.23 36.45,31.62 v36.83,31.75 | v38.35,33.27 v38.35,35.94
V+  (via drill 0.6)
  Top 0.203: R9.2 27.01,13.89 arc-90 Q1.2 27.24,17.08 29.59,19.43 29.59,20.03 C5.2 32.38,22.82 32.38,29.34 32.77,29.72 v36.58,29.72 | v43.81,29.59 48.77,29.59 U$9.V+
  Bottom 0.203: v36.58,29.72 v43.81,29.59
VREF  (via drill 0.6)
  Top 0.203: U$9.VREF 56.26,19.43 v45.72,19.43 | v37.85,17.78 37.38,18.5 C6.2
  Bottom 0.203: v45.72,19.43 v41.66,19.43 40.64,17.78 v37.85,17.78
VREG  (via drill 0.6)
  Top 0.203: C4.1 25.27,28.41 TOS.1 27.81,26.04 | 27.81,26.04 A0.1 v27.81,23.88 | 27.81,26.04 A1.1 A2.1 A3.1 27.81,31.75 R11.2 | v46.61,24.26 49.4,21.97 58.8,21.97 U$9.VREG
  Bottom 0.203: v27.81,23.88 32.89,23.88 34.67,25.65 38.1,25.65 39.24,24.26 v46.61,24.26
VTEMP1
  Top 0.203: R11.1 23.24,32.04 23.24,32.77 24.51,34.04 36.32,34.04 37.34,35.05 59.69,35.05 64.39,30.35 64.39,19.81 U$9.VTEMP1
  Top 0.305: R11.1 23.41,31.88 14.35,31.88 THERM.P$1 13.68,31.2 C7.2
WDTB  (via drill 0.6)
  Top 0.203: R24.2 29.34,17.65 v30.1,18.54 | v46.48,25.53 45.34,24.38 43.94,24.38 43.69,24.13 43.69,22.22 43.18,21.72 41.4,21.72 v41.02,21.21 | v47.75,26.8 47.75,26.29 49.53,24.51 50.29,24.51 51.56,23.24 57.53,23.24 U$9.WDTB
  Bottom 0.203: v30.1,18.54 39.5,18.54 39.75,18.8 39.75,19.81 v41.02,21.21 | v46.48,25.53 v47.75,26.8

### Text on the board
tPlace: C3 | C2 | C1 | C0 | 1 | 0 | SDA | 0 | 1 | 1 | 0 | SCL | ESTOP1 | ESTOP2 | BATT+ | GND | CHGR / IN | VOUT
tNames: ITEST BMS Rev 4